# EAGLE design tripoint (EAGLE 9.1.1)
AUTHOR: Andreas Biri; REV: C; TITLE: TriPoint

## Sheet 1 of 2: Localization module
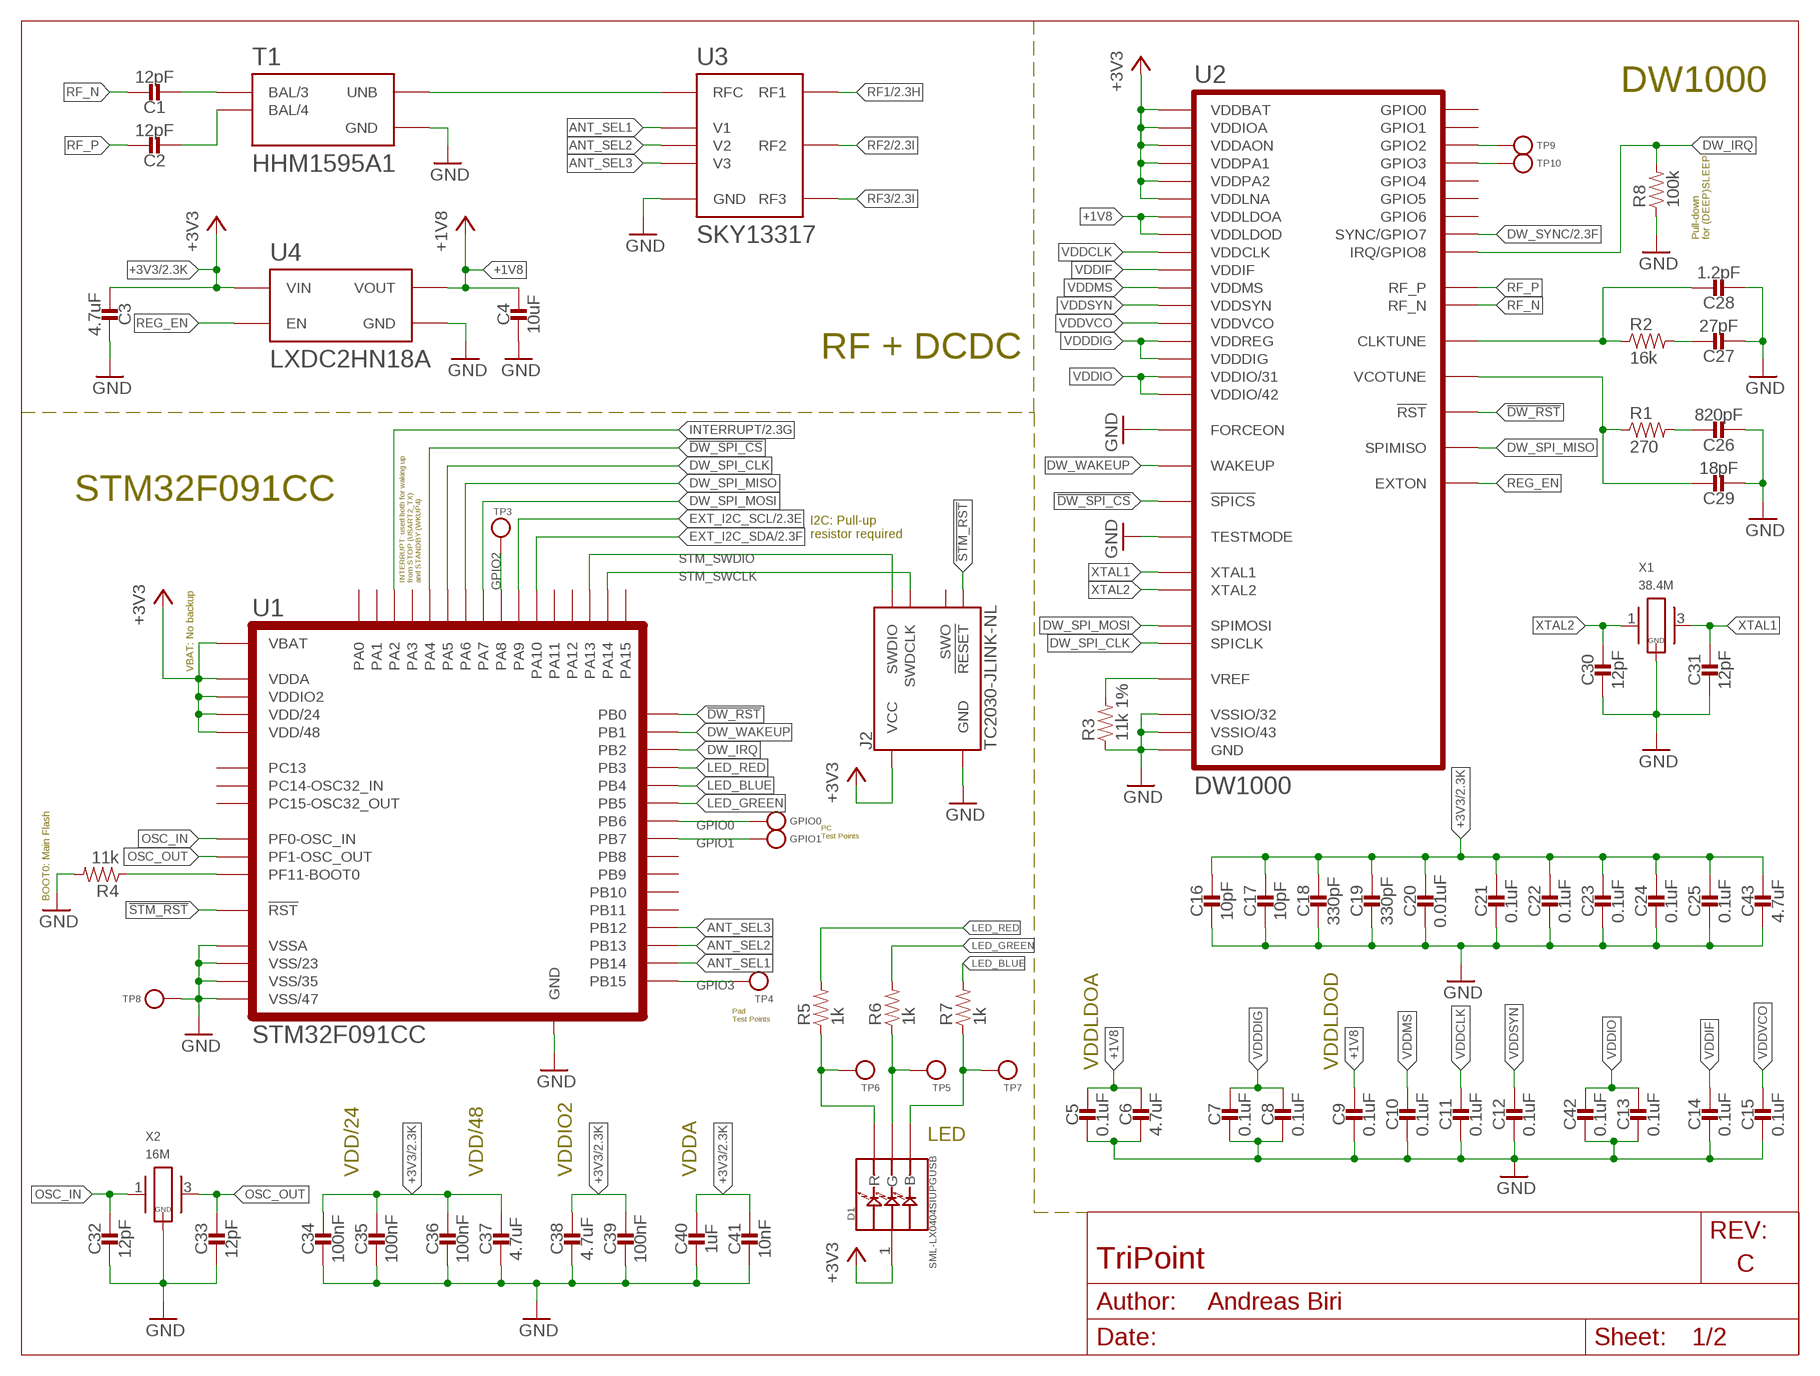
[diagram p0: schematic, sheet 1]

### Parts
C1  12pF  CAPACITOR0201_CAP  [0201_CAP]
C2  12pF  CAPACITOR0201_CAP  [0201_CAP]
C3  4.7uF  CAPACITOR0402_CAP  [0402_CAP]
C4  10uF  CAPACITOR0603_CAP  [0603_CAP]
C5  0.1uF  CAPACITOR0402_CAP  [0402_CAP]
C6  4.7uF  CAPACITOR0402_CAP  [0402_CAP]
C7  0.1uF  CAPACITOR0402_CAP  [0402_CAP]
C8  0.1uF  CAPACITOR0402_CAP  [0402_CAP]
C9  0.1uF  CAPACITOR0402_CAP  [0402_CAP]
C10  0.1uF  CAPACITOR0402_CAP  [0402_CAP]
C11  0.1uF  CAPACITOR0402_CAP  [0402_CAP]
C12  0.1uF  CAPACITOR0402_CAP  [0402_CAP]
C13  0.1uF  CAPACITOR0402_CAP  [0402_CAP]
C14  0.1uF  CAPACITOR0402_CAP  [0402_CAP]
C15  0.1uF  CAPACITOR0402_CAP  [0402_CAP]
C16  10pF  CAPACITOR0402_CAP  [0402_CAP]
C17  10pF  CAPACITOR0402_CAP  [0402_CAP]
C18  330pF  CAPACITOR0402_CAP  [0402_CAP]
C19  330pF  CAPACITOR0402_CAP  [0402_CAP]
C20  0.01uF  CAPACITOR0402_CAP  [0402_CAP]
C21  0.1uF  CAPACITOR0402_CAP  [0402_CAP]
C22  0.1uF  CAPACITOR0402_CAP  [0402_CAP]
C23  0.1uF  CAPACITOR0402_CAP  [0402_CAP]
C24  0.1uF  CAPACITOR0402_CAP  [0402_CAP]
C25  0.1uF  CAPACITOR0402_CAP  [0402_CAP]
C26  820pF  CAPACITOR0402_CAP  [0402_CAP]
C27  27pF  CAPACITOR0402_CAP  [0402_CAP]
C28  1.2pF  CAPACITOR0402_CAP  [0402_CAP]
C29  18pF  CAPACITOR0402_CAP  [0402_CAP]
C30  12pF  CAPACITOR0402_CAP  [0402_CAP]
C31  12pF  CAPACITOR0402_CAP  [0402_CAP]
C32  12pF  CAPACITOR0402_CAP  [0402_CAP]
C33  12pF  CAPACITOR0402_CAP  [0402_CAP]
C34  100nF  CAPACITOR0402_CAP  [0402_CAP]
C35  100nF  CAPACITOR0402_CAP  [0402_CAP]
C36  100nF  CAPACITOR0402_CAP  [0402_CAP]
C37  4.7uF  CAPACITOR0402_CAP  [0402_CAP]
C38  4.7uF  CAPACITOR0402_CAP  [0402_CAP]
C39  100nF  CAPACITOR0402_CAP  [0402_CAP]
C40  1uF  CAPACITOR0402_CAP  [0402_CAP]
C41  10nF  CAPACITOR0402_CAP  [0402_CAP]
C42  0.1uF  CAPACITOR0402_CAP  [0402_CAP]
C43  4.7uF  CAPACITOR0402_CAP  [0402_CAP]
D1  SML-LX0404SIUPGUSB  [1MM_SQ_4PAD]
GPIO0  TEST_POINT_0.040IN  [TESTPOINT_0.040IN]
GPIO1  TEST_POINT_0.040IN  [TESTPOINT_0.040IN]
J2  TC2030-JLINK-NL  [TC2030-IDC-NL]
R1  270  RESISTOR0402_RES  [0402_RES]
R2  16k  RESISTOR0402_RES  [0402_RES]
R3  11k 1%  RESISTOR0402_RES  [0402_RES]
R4  11k  RESISTOR0402_RES  [0402_RES]
R5  1k  RESISTOR0402_RES  [0402_RES]
R6  1k  RESISTOR0402_RES  [0402_RES]
R7  1k  RESISTOR0402_RES  [0402_RES]
R8  100k  RESISTOR0402_RES  [0402_RES]
T1  HHM1595A1  [EIA-0805]
TP3  TEST-POINT  [PAD.03X.03]
TP4  TEST-POINT  [PAD.03X.03]
TP5  TEST-POINT  [PAD.03X.03]
TP6  TEST-POINT  [PAD.03X.03]
TP7  TEST-POINT  [PAD.03X.03]
TP8  TEST-POINT  [PAD.03X.03]
TP9  TEST-POINT  [PAD.03X.03]
TP10  TEST-POINT  [PAD.03X.03]
U1  STM32F091CC  [UFQFPN-48]
U2  DW1000  [QFN-48-DW1000]
U3  SKY13317  [MLPQ-UT-8]
U4  LXDC2HN18A  [LXDC2HN]
X1  38.4M  FA-20H  [FA-20H]
X2  16M  FA-20H  [FA-20H]

### Nets
!DW_RST: U1.18(PB0) U2.27(!RST)
!DW_SPI_CS: U1.14(PA4) U2.24(!SPICS)
!STM_RST: J2.3(!RESET) U1.7(!RST)
+1V8: C4.1 C5.1 C6.1 C9.1 U2.26(VDDLDOD) U2.48(VDDLDOA) U4.3(VOUT)
+3V3: C3.2 C16.1 C17.1 C18.1 C19.1 C20.1 C21.1 C22.1 C23.1 C24.1 C25.1 C34.1 C35.1 C36.1 C37.1 C38.1 C39.1 C40.1 C41.1 C43.1 D1.1(VDD) J2.1(VCC) U1.1(VBAT) U1.9(VDDA) U1.24(VDD/24) U1.36(VDDIO2) U1.48(VDD/48) U2.15(VDDLNA) U2.18(VDDPA1) U2.19(VDDPA2) U2.25(VDDAON) U2.28(VDDIOA) U2.47(VDDBAT) U4.1(VIN) ; also sheet 2
ANT_SEL1: U1.27(PB14) U3.3(V1)
ANT_SEL2: U1.26(PB13) U3.6(V2)
ANT_SEL3: U1.25(PB12) U3.7(V3)
DW_IRQ: R8.2 U1.20(PB2) U2.45(IRQ/GPIO8)
DW_SPI_CLK: U1.15(PA5) U2.41(SPICLK)
DW_SPI_MISO: U1.16(PA6) U2.40(SPIMISO)
DW_SPI_MOSI: U1.17(PA7) U2.39(SPIMOSI)
DW_SYNC: U2.29(SYNC/GPIO7) ; also sheet 2
DW_WAKEUP: U1.19(PB1) U2.23(WAKEUP)
EXT_I2C_SCL: U1.30(PA9) ; also sheet 2
EXT_I2C_SDA: U1.31(PA10) ; also sheet 2
GND: C3.1 C4.2 C5.2 C6.2 C7.2 C8.2 C9.2 C10.2 C11.2 C12.2 C13.2 C14.2 C15.2 C16.2 C17.2 C18.2 C19.2 C20.2 C21.2 C22.2 C23.2 C24.2 C25.2 C26.2 C27.2 C28.2 C29.2 C30.2 C31.2 C32.2 C33.2 C34.2 C35.2 C36.2 C37.2 C38.2 C39.2 C40.2 C41.2 C42.2 C43.2 J2.5(GND) R3.1 R4.2 R8.1 T1.2(GND) T1.5(GND) TP8.P$1(TESTPOINT) U1.8(VSSA) U1.23(VSS/23) U1.35(VSS/35) U1.47(VSS/47) U1.GND U2.22(FORCEON) U2.32(VSSIO/32) U2.43(VSSIO/43) U2.46(TESTMODE) U2.GND U3.GND U4.4(GND) X1.2(GND) X1.4(GND) X2.2(GND) X2.4(GND)
GPIO0: GPIO0.TESTPOINT U1.42(PB6)
GPIO1: GPIO1.TESTPOINT U1.43(PB7)
GPIO2: TP3.P$1(TESTPOINT) U1.29(PA8)
GPIO3: TP4.P$1(TESTPOINT) U1.28(PB15)
INTERRUPT: U1.12(PA2) ; also sheet 2
LED_BLUE: R7.2 U1.40(PB4)
LED_GREEN: R6.2 U1.41(PB5)
LED_RED: R5.2 U1.39(PB3)
N$1: T1.1(UNB) U3.1(RFC)
N$2: C1.P$2 T1.3(BAL/3)
N$3: C2.P$2 T1.4(BAL/4)
N$4: C26.1 R1.2
N$5: C27.1 R2.2
N$6: C29.1 R1.1 U2.12(VCOTUNE)
N$7: R3.2 U2.5(VREF)
N$8: R4.1 U1.44(PF11-BOOT0)
N$9: C28.1 R2.1 U2.8(CLKTUNE)
N$10: D1.4(G) R6.1 TP5.P$1(TESTPOINT)
N$11: D1.3(B) R7.1 TP7.P$1(TESTPOINT)
N$12: D1.2(R) R5.1 TP6.P$1(TESTPOINT)
N$13: TP9.P$1(TESTPOINT) U2.36(GPIO2)
N$14: TP10.P$1(TESTPOINT) U2.35(GPIO3)
OSC_IN: C32.1 U1.5(PF0-OSC_IN) X2.1
OSC_OUT: C33.1 U1.6(PF1-OSC_OUT) X2.3
REG_EN: U2.21(EXTON) U4.2(EN)
RF1: U3.4(RF1) ; also sheet 2
RF2: U3.5(RF2) ; also sheet 2
RF3: U3.8(RF3) ; also sheet 2
RF_N: C1.P$1 U2.17(RF_N)
RF_P: C2.P$1 U2.16(RF_P)
STM_SWCLK: J2.4(SWDCLK) U1.37(PA14)
STM_SWDIO: J2.2(SWDIO) U1.34(PA13)
VDDCLK: C11.1 U2.9(VDDCLK)
VDDDIG: C7.1 C8.1 U2.20(VDDREG) U2.44(VDDDIG)
VDDIF: C14.1 U2.7(VDDIF)
VDDIO: C13.1 C42.1 U2.31(VDDIO/31) U2.42(VDDIO/42)
VDDMS: C10.1 U2.6(VDDMS)
VDDSYN: C12.1 U2.10(VDDSYN)
VDDVCO: C15.1 U2.11(VDDVCO)
XTAL1: C31.1 U2.3(XTAL1) X1.3
XTAL2: C30.1 U2.4(XTAL2) X1.1
Unconnected: J2.6(SWO) U1.2(PC13) U1.3(PC14-OSC32_IN) U1.4(PC15-OSC32_OUT) U1.10(PA0) U1.11(PA1) U1.13(PA3) U1.21(PB10) U1.22(PB11) U1.32(PA11) U1.33(PA12) U1.38(PA15) U1.45(PB8) U1.46(PB9) U2.30(GPIO6) U2.33(GPIO5) U2.34(GPIO4) U2.37(GPIO1) U2.38(GPIO0)

### Notes on the sheet
- DW1000
- Pull-down
  for (DEEP)SLEEP
- RF + DCDC
- STM32F091CC
- I2C: Pull-up
  resistor required
- INTERRUPT: used both for waking up
  from STOP (USART2_TX)
  and STANDBY (WKUP4)
- VBAT: No backup
- PC
  Test Points
- BOOT0: Main Flash
- Pad
  Test Points
- VDDLDOA | VDDLDOD
- LED
- VDD/24 | VDD/48 | VDDIO2 | VDDA

## Sheet 2 of 2: External signals
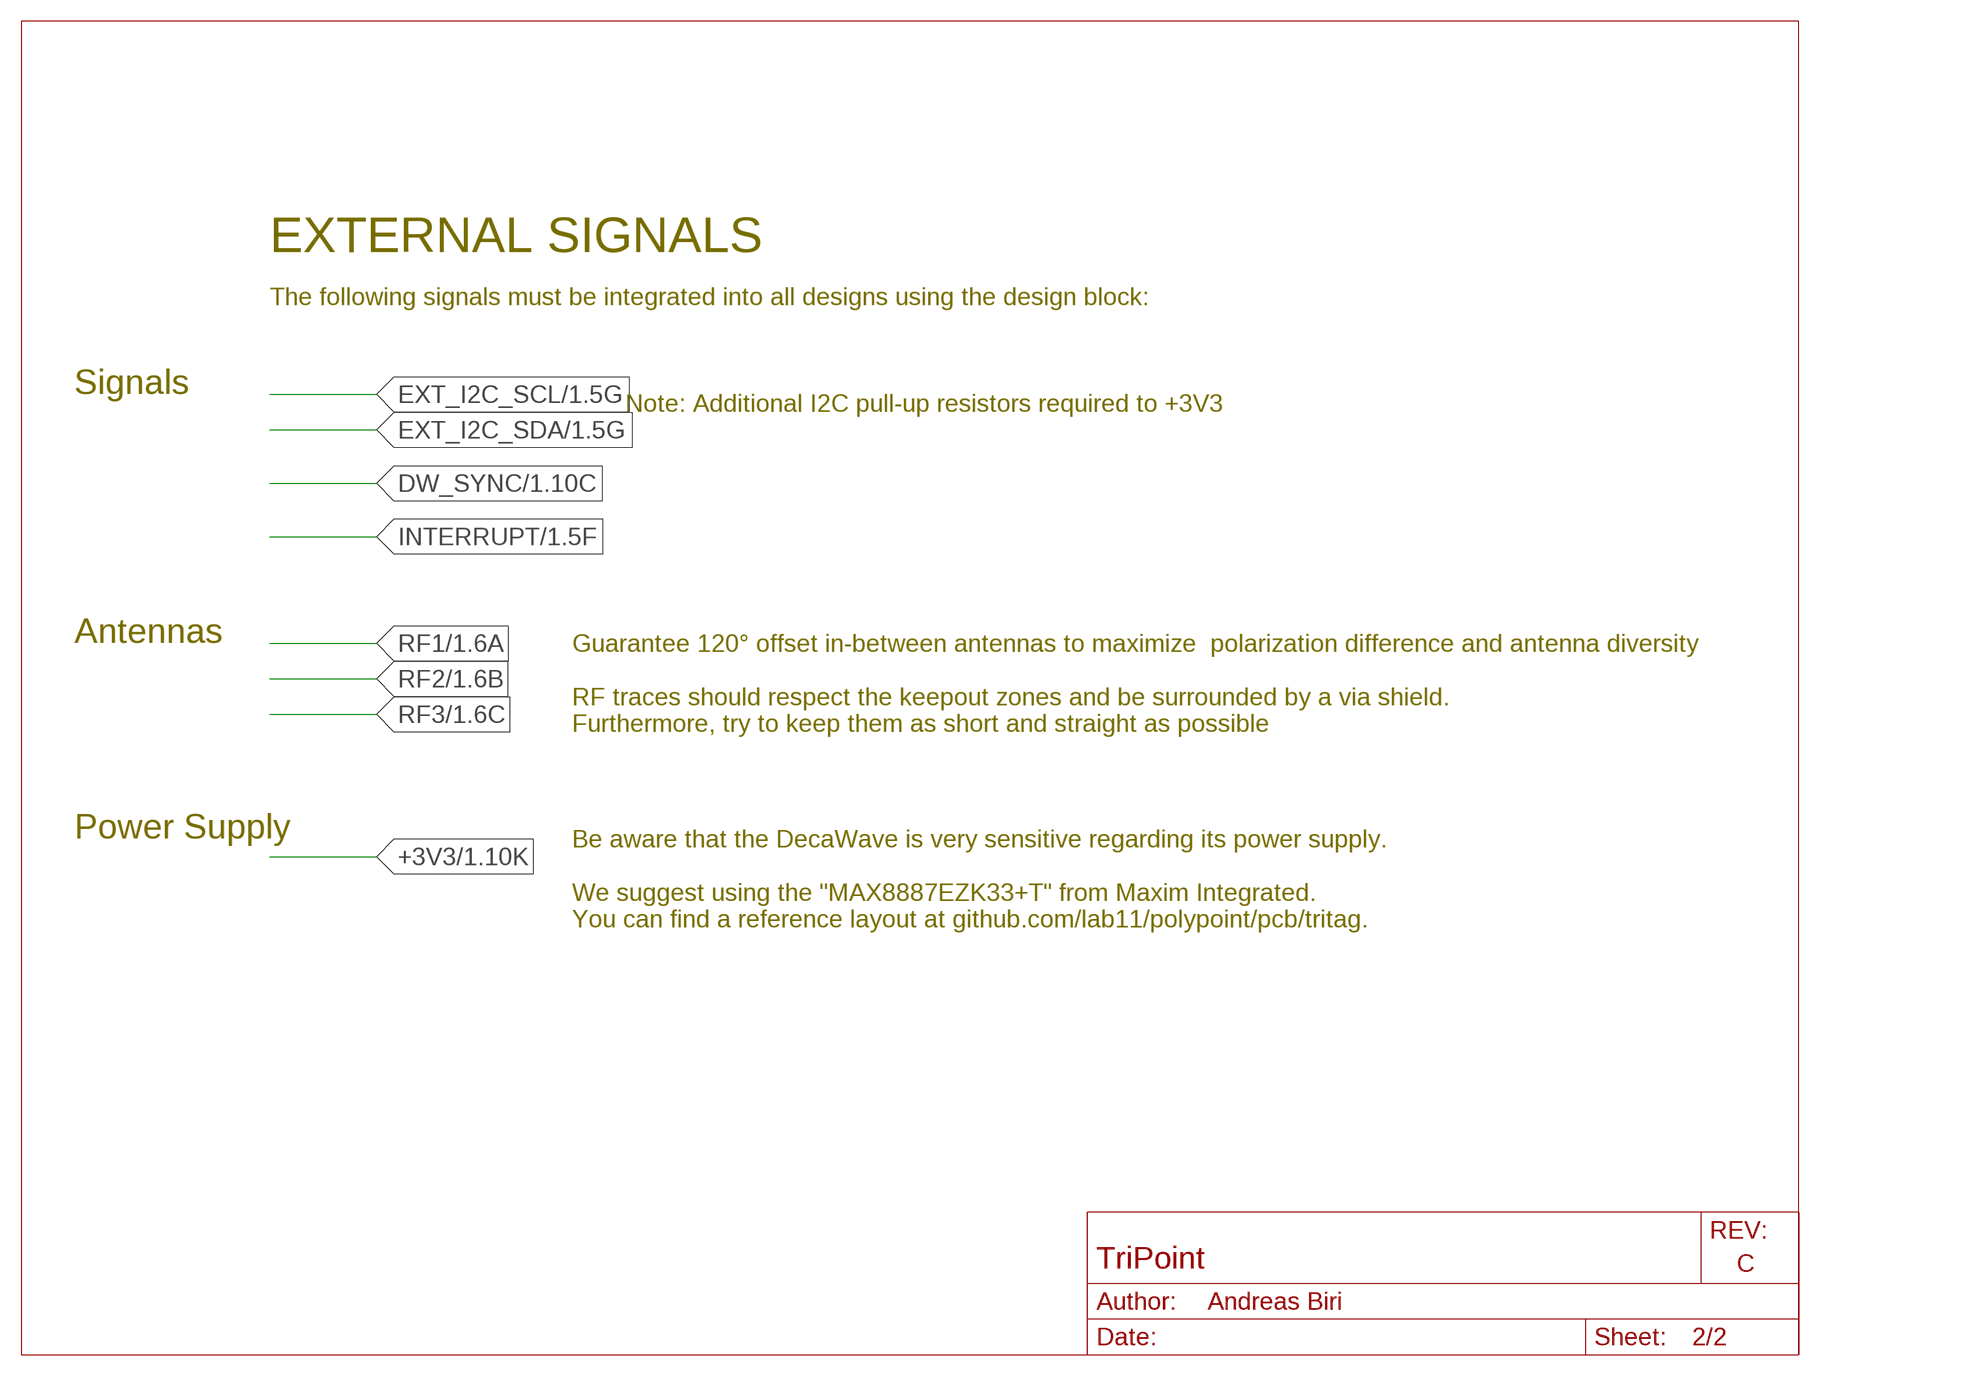
[diagram p1: schematic, sheet 2]

### Notes on the sheet
- EXTERNAL SIGNALS
- The following signals must be integrated into all designs using the design block:
- Signals
- Note: Additional I2C pull-up resistors required to +3V3
- Antennas
- Guarantee 120° offset in-between antennas to maximize  polarization difference and antenna diversity
  
  RF traces should respect the keepout zones and be surrounded by a via shield. 
  Furthermore, try to keep them as short and straight as possible
- Power Supply
- Be aware that the DecaWave is very sensitive regarding its power supply.
  
  We suggest using the "MAX8887EZK33+T" from Maxim Integrated.
  You can find a reference layout at github.com/lab11/polypoint/pcb/tritag.

## Library data of the parts
C1-C43 = passives:CAPACITOR: SMD Capacitor
D1 = leds:SML-LX0404SIUPGUSB: 1mm^2 RGB LED; DIGIKEY: 67-2125-1-ND; MANUFACTURER: Lumex Opto; MPN: SML-LX0404SIUPGUSB
GPIO0 GPIO1 = headers:TEST_POINT_0.040IN: 0.040in Test Point; DIGIKEY: 5001K-ND
J2 = connector:TC2030-JLINK
R1-R8 = passives:RESISTOR: Resistor Basic schematic elements and footprints for 0201, 0402, 0603, 1206, and PTH resistors.
T1 = rf:HHM1595A1: Description: Symbol for HHM1595A1 <https://product.tdk.com/info/en/documents/data_sheet/rf_balun_hhm1595a1_en.pdf>, a multilayer Balun from TDK.; DATASHEET: https://product.tdk.com/info/en/documents/data_sheet/rf_balun_hhm1595a1_en.pdf; DESCRIPTION: XFMR BALUN RF 3.0-8.0GHZ UWB SMD; DIGIKEY: 445-3387-1-ND; MANUFACTURER: TDK Corporation; MOUSER: 810-HHM1595A1; MPN: HHM1595A1
TP3-TP10 = headers:TEST-POINT
U1 = chips:STM32F091CC: Description: STM32F091CC <https://www.st.com/resource/en/datasheet/stm32f091cc.pdf> from STMicroelectronics, an ARM-based 32-bit MCU with 256 kB Flash, 32kB of SRAM and a Cortex M0; DATASHEET: https://www.st.com/resource/en/datasheet/stm32f091cc.pdf; DESCRIPTION: IC MCU 32BIT 256KB FLASH 48QFPN; DIGIKEY: 497-15813-ND; MANUFACTURER: STMicroelectronics; MOUSER: 511-STM32F091CCU6; MPN: STM32F091CCU6
U2 = chips:DW1000: Description: The DecaWave DW1000 <https://www.decawave.com/sites/default/files/resources/dw1000-datasheet-v2.13.pdf> chip, used for UWB two-way ranging.; DATASHEET: https://www.decawave.com/sites/default/files/resources/dw1000-datasheet-v2.13.pdf; DESCRIPTION: IC RF TXRX 802.15.4 48-QFN; DIGIKEY: 1479-1001-1-ND; MANUFACTURER: Decawave Limited; MPN: DW1000-I-TR13
U3 = switches:SKY13317: Description: Device for SKY13317-373LF <http://www.skyworksinc.com/uploads/documents/SKY13317_373LF_200914K.pdf>, an RF switch from Skyworks Inc.; DATASHEET: http://www.skyworksinc.com/uploads/documents/SKY13317_373LF_200914K.pdf; DESCRIPTION: IC SWITCH RF SP3T 8-MLP; DIGIKEY: 863-1056-1-ND; MANUFACTURER: Skyworks Solutions Inc.; MPN: SKY13317-373LF
U4 = regulators:LXDC2HN18A: Description: Symbol for LXDC2HN18A-097 <https://www.murata.com/~/media/webrenewal/campaign/ads/america/udcdc/lxdc_product_brief.ashx>, a DC-DC converter by Murata Electronics. ATTENTION: LAST TIME BUY; DATASHEET: https://www.murata.com/~/media/webrenewal/campaign/ads/america/udcdc/lxdc_product_brief.ashx; DESCRIPTION: DC/DC CONVERTER SMD; DIGIKEY: 490-12092-1-ND; MANUFACTURER: Murata Electronics North America; MPN: LXDC2HN18A-097
X1 = crystals:FA-20H: Description: Oscillator by EPSON from 12MHz to 54 MHz; DATASHEET: https://support.epson.biz/td/api/doc_check.php?dl=brief_FA-20H_en.pdf; DESCRIPTION: 38.4MHz ±10ppm Crystal 8.5pF 40 Ohms 4-SMD, No Lead; DIGIKEY: SER3631CT-ND; MANUFACTURER: EPSON
X2 = crystals:FA-20H: Description: Oscillator by EPSON from 12MHz to 54 MHz; DATASHEET: https://support.epson.biz/td/api/doc_check.php?dl=brief_FA-20H_en.pdf; DESCRIPTION: 16MHz ±10ppm Crystal 8pF 80 Ohms 4-SMD, No Lead; DIGIKEY: SER3913CT-ND; MANUFACTURER: EPSON

## Board
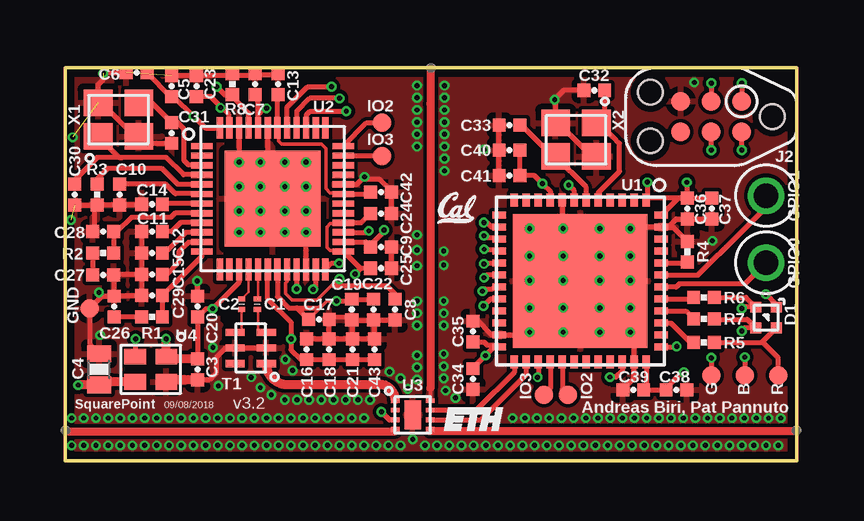
[diagram p2: board, top side]
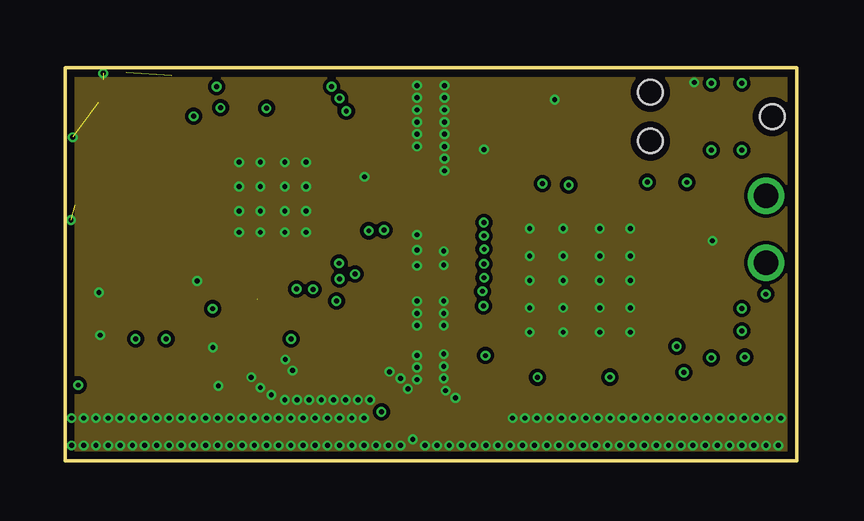
[diagram p3: board, inner layer Route2]
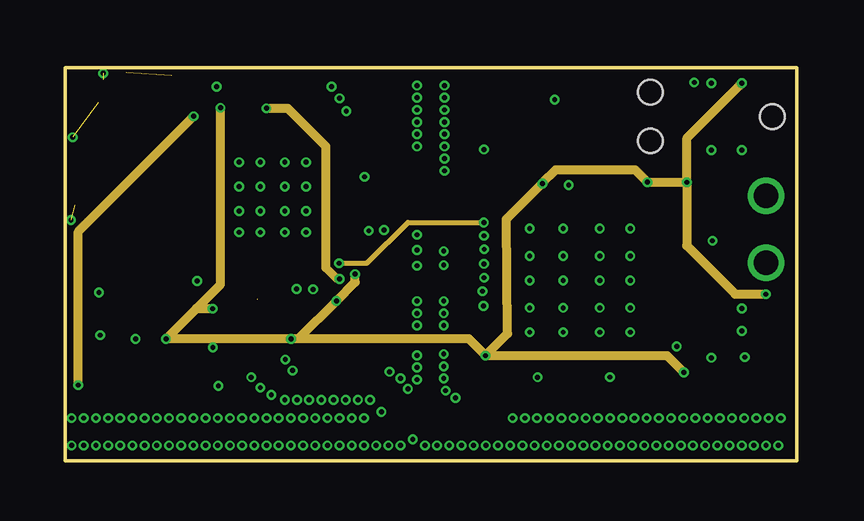
[diagram p4: board, inner layer Route15]
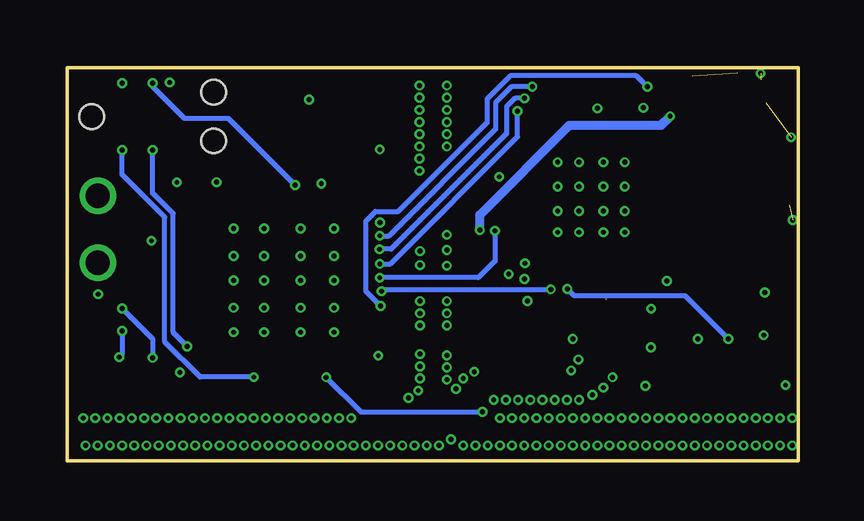
[diagram p5: board, bottom side, seen from below]

Size 30.48 x 16.38 mm. Coordinates in mm from the lower left corner, seen from the top.
Outline: 30.48,0 30.48,16.38 0,16.38 0,0 30.48,0
Copper layers (1+2*15+16): Top 0.0356mm / dielectric 0.18mm / Route2 0.0356mm / dielectric 1.03mm / Route15 0.0356mm / dielectric 0.18mm / Bottom 0.0356mm
Design rules "quickturn_co_kr_1oz_4lyr *": minimum track width 4mil, minimum drill 8mil, track to track 6mil, track to pad 6mil, pad to pad 6mil, via to via 6mil, smd to smd 6mil, copper to edge 12mil, drill to drill 12mil, minimum pad ring 8mil, minimum via ring 4mil, stop-mask expansion 3mil, vias tented up to drill 50mil, thermal gap 10mil
tKeepout: area 0.5,0.1 to 13.5,2.2; area 15.5,0.1 to 30,2.2; area 14.2,2.9 to 16.3,16
tRestrict: area 6.5,5.6 to 7.4,7.1

### Footprints (pad centres in the part's own frame; a part is rotated, then mirrored left to right if it is on the bottom)
0201_CAP = smd 0.3 x 0.21: P$1 0,0.22; P$2 0,-0.22
0402_CAP = smd 0.536 x 0.546: 1 -0.433,0; 2 0.433,0
0603_CAP = smd 0.7 x 1: 1 -0.65,0; 2 0.65,0
1MM_SQ_4PAD = smd 0.457 x 0.457: 1 0.432,0.432; 2 0.432,-0.432; 3 -0.432,-0.432; 4 -0.432,0.432
TESTPOINT_0.040IN = drill 1.016: TESTPOINT 0,0
TC2030-IDC-NL = smd 0.787 x 0.787: 1 -1.27,-0.635; 2 -1.27,0.635; 3 0,-0.635; 4 0,0.635; 5 1.27,-0.635; 6 1.27,0.635 | hole 1.016: -2.54,0; 2.54,1.016; 2.54,-1.016
0402_RES = smd 0.536 x 0.546: 1 -0.433,0; 2 0.433,0
EIA-0805 = smd 0.3 x 0.8: 1 -0.65,-0.65; 2 0,-0.65; 3 0.65,-0.65; 4 0.65,0.65; 5 0,0.65; 6 -0.65,0.65
PAD.03X.03 = smd 0.762 x 0.762: P$1 0,0
UFQFPN-48 = smd 0.55 x 0.3: 1 -3.375,2.75; 2 -3.375,2.25; 3 -3.375,1.75; 4 -3.375,1.25; 5 -3.375,0.75; 6 -3.375,0.25; 7 -3.375,-0.25; 8 -3.375,-0.75; 9 -3.375,-1.25; 10 -3.375,-1.75; 11 -3.375,-2.25; 12 -3.375,-2.75; 25 3.375,-2.75; 26 3.375,-2.25; 27 3.375,-1.75; 28 3.375,-1.25; 29 3.375,-0.75; 30 3.375,-0.25; 31 3.375,0.25; 32 3.375,0.75; 33 3.375,1.25; 34 3.375,1.75; 35 3.375,2.25; 36 3.375,2.75 | smd 0.3 x 0.55: 13 -2.75,-3.375; 14 -2.25,-3.375; 15 -1.75,-3.375; 16 -1.25,-3.375; 17 -0.75,-3.375; 18 -0.25,-3.375; 19 0.25,-3.375; 20 0.75,-3.375; 21 1.25,-3.375; 22 1.75,-3.375; 23 2.25,-3.375; 24 2.75,-3.375; 37 2.75,3.375; 38 2.25,3.375; 39 1.75,3.375; 40 1.25,3.375; 41 0.75,3.375; 42 0.25,3.375; 43 -0.25,3.375; 44 -0.75,3.375; 45 -1.25,3.375; 46 -1.75,3.375; 47 -2.25,3.375; 48 -2.75,3.375 | smd 5.6 x 5.6: GND 0,0
QFN-48-DW1000 = smd 0.9 x 0.26: 1 -2.95,2.2; 2 -2.95,1.8; 3 -2.95,1.4; 4 -2.95,1; 5 -2.95,0.6; 6 -2.95,0.2; 7 -2.95,-0.2; 8 -2.95,-0.6; 9 -2.95,-1; 10 -2.95,-1.4; 11 -2.95,-1.8; 12 -2.95,-2.2; 25 2.95,-2.2; 26 2.95,-1.8; 27 2.95,-1.4; 28 2.95,-1; 29 2.95,-0.6; 30 2.95,-0.2; 31 2.95,0.2; 32 2.95,0.6; 33 2.95,1; 34 2.95,1.4; 35 2.95,1.8; 36 2.95,2.2 | smd 0.26 x 0.9: 13 -2.2,-2.95; 14 -1.8,-2.95; 15 -1.4,-2.95; 16 -1,-2.95; 17 -0.6,-2.95; 18 -0.2,-2.95; 19 0.2,-2.95; 20 0.6,-2.95; 21 1,-2.95; 22 1.4,-2.95; 23 1.8,-2.95; 24 2.2,-2.95; 37 2.2,2.95; 38 1.8,2.95; 39 1.4,2.95; 40 1,2.95; 41 0.6,2.95; 42 0.2,2.95; 43 -0.2,2.95; 44 -0.6,2.95; 45 -1,2.95; 46 -1.4,2.95; 47 -1.8,2.95; 48 -2.2,2.95 | smd 4 x 4: GND 0,0
MLPQ-UT-8 = smd 0.35 x 0.2: 1 -0.725,0.6; 2 -0.725,0.2; 3 -0.725,-0.2; 4 -0.725,-0.6; 5 0.725,-0.6; 6 0.725,-0.2; 7 0.725,0.2; 8 0.725,0.6 | smd 0.7 x 1.2: GND 0,0
LXDC2HN = smd 0.65 x 0.9: 1 -0.525,0.65; 2 -0.525,-0.65; 3 0.525,-0.65; 4 0.525,0.65
FA-20H = smd 1.1 x 1.2: 1 -0.7,0.85; 2 -0.7,-0.85; 3 0.7,-0.85; 4 0.7,0.85

### Placement (x,y rotation side)
C1  8,6.53 0 top
C2  7.34,6.53 0 top
C3  5.51,3.81 90 top
C4  1.4,3.81 90 top
C5  4.42,15.62 90 top
C6  2.97,16.18 180 top
C7  7.9,15.7 90 top
C8  13.74,6.3 270 top
C9  13.16,8.92 0 top
C10  2.26,11.1 270 top
C11  3.61,9.55 180 top
C12  3.61,8.66 180 top
C13  8.86,15.7 90 top
C14  3.61,10.69 180 top
C15  3.61,7.77 180 top
C16  10.06,4.65 90 top
C17  10.57,5.89 0 top
C18  11,4.65 90 top
C19  11.94,6.3 270 top
C20  5.51,6.43 90 top
C21  11.96,4.65 90 top
C22  12.85,6.3 270 top
C23  5.46,15.62 90 top
C24  13.16,10.31 0 top
C25  13.16,8.03 0 top
C26  2.03,6.43 90 top
C27  1.57,7.75 0 top
C28  1.57,9.55 180 top
C29  3.61,6.88 180 top
C30  0.38,11.1 270 top
C31  4.42,13.67 270 top
C32  22.05,15.44 180 top
C33  18.52,14 180 top
C34  16.99,3.4 270 top
C35  16.99,5.38 90 top
C36  25.93,10.52 270 top
C37  26.95,10.52 270 top
C38  25.48,2.95 0 top
C39  23.67,2.95 180 top
C40  18.52,12.95 180 top
C41  18.52,11.89 180 top
C42  13.16,11.2 0 top
C43  12.88,4.65 90 top
D1  29.21,5.97 0 top
GPIO0  29.21,8.25 0 top
GPIO1  29.21,11.05 0 top
J2  26.92,14.35 180 top
R1  3.61,5.99 180 top
R2  1.57,8.66 180 top
R3  1.32,11.1 90 top
R4  25.93,8.71 90 top
R5  26.62,4.93 180 top
R6  26.62,6.81 180 top
R7  26.62,5.92 180 top
R8  6.96,15.7 270 top
T1  7.72,4.7 90 top
TP3  20.95,2.74 0 top
TP4  19.94,2.74 0 top
TP5  26.92,3.56 0 top
TP6  29.72,3.56 0 top
TP7  28.32,3.56 0 top
TP8  1.02,6.35 0 top
TP9  13.21,14.1 0 top
TP10  13.21,12.7 0 top
U1  21.46,7.49 270 top
U2  8.64,10.92 0 top
U3  14.48,1.9 0 top
U4  3.56,3.81 270 top
U$1  [ETH_100MIL]  16.89,1.27 0 top
U$2  [UCB_CAL_50MIL]  15.49,9.91 0 top
X1  2.21,14.22 90 top
X2  21.29,13.39 270 top

### Tracks (layer width: path | path; a pad name or v marks a point on that pad's centre or on a via)
!DW_RST  (via drill 0.2)
  Top 0.203: U2.27 12.58,9.52 v12.65,9.59 | U1.18 18.07,7.76 17.58,7.76 v17.45,7.63
  Bottom 0.203: v17.45,7.63 13.34,7.63 12.65,8.32 v12.65,9.59
!DW_SPI_CS  (via drill 0.2)
  Top 0.203: U2.24 11.1,8.24 v11.41,8.24 | U1.14 17.76,9.74 17.57,9.94 v17.44,9.94
  Route15 0.203: v17.44,9.94 14.27,9.94 12.57,8.24 v11.41,8.24
!STM_RST  (via drill 0.2)
  Top 0.203: U1.7 21.21,11.26 v20.98,11.49 | v26.92,15.75 J2.3
  Bottom 0.203: v20.98,11.49 23.76,14.27 25.59,14.27 26.92,15.6 v26.92,15.75
+1V8  (via drill 0.2)
  Top 0.203: U2.48 5.84,13.87 v5.35,14.36 4.52,15.19 C5.1 4.39,15.19 3.42,16.15 3.42,16.17 C6.1 | U2.26 12.52,9.12 C9.1 12.72,8.99 13.28,9.55 v13.28,9.62
  Top 0.381: U4.3 1.52,3.28 C4.1 0.54,3.16 v0.53,3.15
  Route15 0.381: v0.53,3.15 0.53,9.55 v5.35,14.36
  Bottom 0.381: v5.35,14.36 5.72,13.98 9.55,13.98 13.28,10.25 v13.28,9.62
+3V3  (via drill 0.2)
  Top 0.152: U2.25 11.54,8.76 11.04,8.76 10.91,8.9 10.91,9.75 11.04,9.88 11.54,9.88 U2.28 | U2.47 6.82,13.89 | C17.1 10.57,6.32 10.63,6.39 10.91,6.66 v11.3,6.66
  Top 0.203: U1.48 25.54,10.95 C36.1 | C36.1 C37.1 | C36.1 25.93,11.58 v25.91,11.61 | v28.19,15.75 J2.1 | C36.1 24.29,10.95 U1.1 24.26,10.91 v24.26,11.61 | U1.36 24.21,3.05 C39.1 C38.1 25.04,3.03 25.69,3.68 v25.79,3.68 | 6.82,13.89 6.82,14.43 6.5,14.75 | 6.5,14.75 6.06,15.19 C23.1 | U2.15 7.24,7.43 v6.14,6.34 5.86,6.34 C20.1 C3.2 | U2.18 8.44,6.75 9.41,5.78 v9.41,5.08 9.41,4.63 9.82,4.21 C16.1 C18.1 C21.1 C43.1 | 9.65,6.38 9.31,6.38 8.84,6.85 U2.19 | U2.25 12.28,8.03 C25.1 12.33,8.03 v12.08,7.78 | U2.28 12.33,9.92 C24.1 | C35.1 17.45,4.95 17.58,4.82 18.01,4.82 U1.24 17.87,4.74 v17.51,4.38 16.99,3.86 C34.1 | D1.1 29.64,6.5 v29.2,6.94 | 9.65,6.38 C17.1 | C22.1 C19.1 11.87,6.66 v11.3,6.66 | C40.1 C41.1 19.56,11.89 v19.89,11.56 20.23,11.21 20.23,10.88 U1.9 | 9.65,6.38 10.58,6.38 | v6.46,14.72 6.5,14.75
  Top 0.381: C3.2 4.3,4.24 U4.1 4.21,5.06 v4.19,5.08
  Route15 0.203: v25.9,11.61 v25.91,11.61
  Route15 0.381: v25.91,11.61 25.91,13.46 v28.19,15.75 | 6.46,7.35 v6.46,14.72 | 6.46,7.35 | v17.51,4.38 16.8,5.09 9.73,5.09 | 5.46,6.35 v4.19,5.08 4.2,5.09 9.73,5.09 | 5.46,6.35 6.46,7.35 | v29.2,6.94 27.93,6.94 25.9,8.97 v25.9,11.61 v24.26,11.61 24.26,11.63 23.75,12.14 20.44,12.14 19.88,11.57 v19.89,11.56 19.86,11.56 18.38,10.07 18.43,5.3 v17.51,4.38 | v17.51,4.38 25.08,4.38 v25.79,3.68 | v12.08,7.78 12.08,7.45 v11.3,6.66 9.73,5.1 9.73,5.09 | 5.46,6.35 6.13,6.35 v6.14,6.34 | 9.73,5.09 | v9.41,5.08 9.73,5.09
ANT_SEL1  (via drill 0.2)
  Top 0.152: U3.3 13.83,1.7
  Top 0.203: U1.27 19.71,3.51 v19.69,3.48 | v13.17,2.03 13.51,1.7 13.83,1.7
  Bottom 0.203: v19.69,3.48 18.24,2.03 v13.17,2.03
ANT_SEL2
  Top 0.203: U3.6 17.33,1.71 19.21,3.59 U1.26
ANT_SEL3
  Top 0.203: U1.25 18.71,3.69 17.14,2.11 15.13,2.11 U3.7
DW_IRQ  (via drill 0.2)
  Top 0.203: U2.45 7.64,14.5 6.96,15.18 R8.2 6.63,15.26 v6.3,15.59 | U1.20 17.71,6.74 v17.42,6.46
  Bottom 0.203: v17.42,6.46 18.03,7.07 18.03,9.99 17.63,10.39 16.68,10.39 12.98,14.1 12.98,15.08 12.06,16 12.01,16.05 6.76,16.05 v6.3,15.59
DW_SPI_CLK  (via drill 0.2)
  Top 0.203: U2.41 9.24,14.73 10.1,15.6 v11.09,15.6 | v17.45,9.38 17.53,9.29 18.04,9.29 U1.15
  Bottom 0.203: v17.45,9.38 17.07,9.38 12.62,13.82 12.62,14.93 11.96,15.6 v11.09,15.6
DW_SPI_MISO  (via drill 0.2)
  Top 0.203: U2.40 9.65,13.89 9.65,14.58 10.19,15.11 v11.42,15.11 | v17.46,8.82 17.48,8.79 18.04,8.79 U1.16
  Bottom 0.203: v17.46,8.82 16.98,8.82 12.17,13.63 12.17,14.77 11.82,15.11 v11.42,15.11
DW_SPI_MOSI  (via drill 0.2)
  Top 0.203: U2.39 10.05,13.89 10.05,14.43 10.2,14.58 v11.71,14.58 | v17.45,8.21 v17.46,8.22 18.06,8.22 U1.17
  Bottom 0.203: v17.45,8.21 17.01,8.21 11.71,13.51 v11.71,14.58
DW_WAKEUP  (via drill 0.2)
  Top 0.203: U1.19 17.89,7.24 17.81,7.17 17.48,7.17 v17.38,7.06 | U2.23 10.43,7.96 10.43,7.25 v10.32,7.15
  Bottom 0.203: v10.32,7.15 10.35,7.12 17.44,7.12 v17.38,7.06
GND  (via drill 0.2)  (4 unrouted)
  Top 0.152: 8.76,10.92 U2.GND 8.67,10.96 8.43,11.2 9.14,10.96 8.87,10.68 8.87,11.1 v9.14,11.43
  Top 0.203: 24.87,9.71 25.09,9.71 25.46,10.08 C36.2 C37.2 | 24.87,9.71 U1.47 23.84,9.74 21.53,7.43 | R4.2 25.37,9.71 24.87,9.71 | 21.72,7.24 23.71,5.24 U1.35 23.67,4.07 23.67,3.41 23.24,2.98 C39.2 | 21.72,7.24 21.53,7.43 | 21.53,7.43 U1.GND | 21.72,7.24 19.72,5.24 U1.23 17.77,5.24 17.7,5.32 17.2,5.82 C35.2 | 21.53,7.43 20.71,8.24 U1.8 20.74,10.9 | U2.43 8.44,11.12 8.51,11.05 | 8.51,11.05 U2.GND | U2.46 7.24,12.32 8.51,11.05 | U2.22 10.04,9.65 8.95,10.73 8.76,10.92 | C13.2 8.81,16.08 7.95,16.08 C7.2 7.82,16.05 7.04,16.05 R8.1 6.88,16.05 C23.2 C5.2 | C14.2 3.15,10.67 C10.2 R3.1 | C30.2 R3.1 | C28.2 1.19,9.6 1.19,10.54 R3.1 | C11.2 C12.2 C15.2 | C15.2 2.03,7.77 2.03,7.75 | C15.2 C29.2 3.15,6.86 C26.2 | 1.53,6.86 TP8.P$1 1.02,4.84 C4.2 | 1.53,6.86 C26.2 | C20.2 5.51,7.47 v5.49,7.49 | C3.1 6,3.38 6.29,3.66 6.29,4.3 6.69,4.7 T1.5 T1.2 | C21.2 C43.2 12.88,5.84 | C21.2 C18.2 | C18.2 C16.2 | C18.2 C17.2 11.1,5.99 11.81,5.99 C19.2 | C21.2 11.96,5.84 | 11.96,5.84 C19.2 | 12.88,5.84 C22.2 C8.2 | C19.2 11.96,5.84 | 11.96,5.84 12.88,5.84 | C25.2 C9.2 | C24.2 C42.2 | 13.5,11.2 C42.2 | U2.32 12.14,11.52 12.35,11.73 13.1,11.73 13.59,11.23 C42.2 | C26.2 2.03,7.75 | 2.03,7.75 C27.2 | v1.4,7.01 1.4,6.99 1.53,6.86 | C41.2 C40.2 C33.2 | X2.4 21.94,12.69 20.89,13.74 20.9,13.74 20.56,14.09 X2.2 20.44,15.02 v20.4,15.06 v20.39,15.06 20.78,15.44 C32.2 | C6.2 2.51,16.15 v1.58,16.15 | 1.58,15.9 1.36,15.68 X1.4 1.48,14.92 2.23,14.18 2.88,13.52 X1.2 3.35,13.23 C31.2
  Top 0.381: C3.1 4.3,3.38 U4.4
  other vias: 0.25,1.78 0.76,1.78 1.27,1.78 1.78,1.78 2.29,1.78 2.79,1.78 3.3,1.78 3.81,1.78 4.32,1.78 4.83,1.78 5.33,1.78 5.84,1.78 6.35,1.78 6.86,1.78 7.37,1.78 7.87,1.78 8.38,1.78 8.89,1.78 9.4,1.78 9.91,1.78 10.41,1.78 10.92,1.78 11.43,1.78 11.94,1.78 12.45,1.78 12.7,2.54 12.19,2.54 11.68,2.54 11.18,2.54 10.67,2.54 10.16,2.54 9.65,2.54 9.14,2.54 8.59,2.74 8.13,3.05 7.75,3.48 13.51,3.71 13.97,3.43 14.27,3 14.66,3.38 14.66,3.89 14.66,4.39 14.66,5.64 14.66,6.15 14.66,6.65 14.66,8.13 14.66,8.79 14.66,9.42 15.77,8.74 15.77,8.15 14.66,13.11 14.66,13.61 14.66,14.12 14.66,14.63 14.66,15.14 14.66,15.65 15.8,15.65 15.8,15.14 15.8,14.63 15.8,14.12 15.8,13.61 15.8,13.11 15.8,12.6 15.8,12.09 15.77,6.65 15.77,6.15 15.77,5.64 15.77,4.44 15.77,3.94 15.77,3.43 15.85,2.92 16.26,2.62 18.64,1.78 19.15,1.78 19.66,1.78 20.17,1.78 20.68,1.78 21.18,1.78 21.69,1.78 22.2,1.78 22.71,1.78 23.22,1.78 23.72,1.78 24.23,1.78 24.74,1.78 25.25,1.78 25.76,1.78 26.26,1.78 26.77,1.78 27.28,1.78 27.79,1.78 28.3,1.78 28.8,1.78 29.31,1.78 29.82,1.78 10.03,12.45 8.13,12.45 7.24,12.45 7.24,11.43 8.13,11.43 9.14,12.45 10.03,11.43 10.03,10.41 10.03,9.52 9.14,9.52 8.13,9.52 7.24,9.52 7.24,10.41 8.13,10.41 9.14,10.41 19.35,9.68 20.75,9.68 22.28,9.68 23.55,9.68 23.55,8.53 22.28,8.53 19.35,8.53 22.28,7.52 23.55,7.52 20.75,7.52 20.75,6.38 20.75,5.36 19.35,5.36 22.28,5.36 23.55,5.36 23.55,6.38 22.28,6.38 19.35,6.38 26.21,15.77 17.45,12.98 0.25,0.63 0.76,0.63 1.27,0.63 1.78,0.63 2.29,0.63 2.79,0.63 3.3,0.63 3.81,0.63 4.32,0.63 4.83,0.63 5.33,0.63 5.84,0.63 6.35,0.63 6.86,0.63 7.37,0.63 7.87,0.63 8.38,0.63 8.89,0.63 9.4,0.63 9.91,0.63 10.41,0.63 10.92,0.63 11.43,0.63 11.94,0.63 12.45,0.63 12.95,0.63 13.46,0.63 13.97,0.63 14.48,0.89 14.99,0.63 15.49,0.63 16,0.63 16.51,0.63 17.02,0.63 17.53,0.63 18.03,0.63 18.54,0.63 19.05,0.63 19.56,0.63 20.07,0.63 20.57,0.63 21.08,0.63 21.59,0.63 22.1,0.63 22.61,0.63 23.11,0.63 23.62,0.63 24.13,0.63 24.64,0.63 25.15,0.63 25.65,0.63 26.16,0.63 26.67,0.63 27.18,0.63 27.69,0.63 28.19,0.63 28.7,0.63 29.21,0.63 29.72,0.63 0.23,10.03 0.3,13.49 1.45,5.23 6.15,4.72 6.38,3.12 12.47,11.84 9.17,4.22 26.97,9.17 20.75,8.53 19.35,7.52 9.47,3.76
  pour Top (rank 6): 0,16.38 30.48,16.38 30.48,0 0,0
  pour Route2 (rank 6): 0,16.38 0,0 30.48,0 30.48,16.38
GPIO0
  Top 0.203: GPIO0.TESTPOINT 28.34,7.38 25.61,7.38 25.47,7.24 U1.42
GPIO1
  Top 0.203: U1.43 26.37,7.74 28.11,9.48 29.21,10.58 GPIO1.TESTPOINT
GPIO2
  Top 0.203: U1.29 20.71,2.98 TP3.P$1
GPIO3
  Top 0.203: U1.28 20.21,3.02 TP4.P$1
LED_BLUE
  Top 0.203: U1.40 25.86,6.24 R7.2
LED_GREEN
  Top 0.203: U1.41 26.12,6.74 R6.2
LED_RED
  Top 0.203: U1.39 25.24,5.74 26.06,4.93 R5.2
N$1
  Top 0.152: U3.1 13.74,2.52 13.74,2.54
  Top 0.381: T1.1 arc90 9.25,3.17 13.08,3.17 13.11,3.17 arc-90 13.74,2.54
  pour Top: 13.56,2.54 13.56,2.44 arc90 13.59,2.41 13.59,2.54
N$2
  Top 0.102: T1.3 8.14,5.35 8.03,5.47 8.03,6.28 C1.P$2
N$3
  Top 0.102: C2.P$2 7.34,5.47 7.22,5.35 T1.4
N$4
  Top 0.203: R1.2 C26.1
N$5
  Top 0.203: R2.2 C27.1
N$6
  Top 0.203: U2.12 5.69,8.52 4.41,7.24 4.4,7.24 C29.1 R1.1
N$7
  Top 0.203: U2.5 4.7,11.52 4.04,12.18 1.76,12.18 1.32,11.75 R3.2
N$8
  Top 0.203: U1.44 25.9,8.24 R4.1
N$9
  Top 0.203: U2.8 4.57,10.32 4.39,10.14 2.75,10.14 2.16,9.55 C28.1 R2.1
N$10  (via drill 0.2)
  Top 0.203: R6.1 28.37,6.81 D1.4 28.25,6.4 v28.19,6.35 | v26.92,4.29 TP5.P$1
  Bottom 0.203: v28.19,6.35 26.92,5.08 v26.92,4.29
N$11  (via drill 0.2)
  Top 0.203: v28.19,5.41 28.32,5.54 D1.3 28.42,5.89 27.08,5.89 R7.1 | v28.32,4.32 TP7.P$1
  Bottom 0.203: v28.19,5.41 28.19,4.44 v28.32,4.32
N$12
  Top 0.203: R5.1 29.08,4.93 | D1.2 29.06,4.95 29.08,4.93 | TP6.P$1 29.72,4.29 29.08,4.93
N$13
  Top 0.203: U2.36 12.56,14.1 TP9.P$1
N$14
  Top 0.203: U2.35 13.19,12.72 TP10.P$1
OSC_IN
  Top 0.203: X2.1 22.19,14.14 | 22.19,14.14 22.48,14.43 C32.1 | U1.5 22.21,11.17 23.1,12.06 23.1,13.23 22.84,13.49 22.83,13.49 22.19,14.14
OSC_OUT
  Top 0.203: U1.6 21.71,11.41 X2.3 20.33,12.69 19.02,14 C33.1
REG_EN  (via drill 0.2)
  Top 0.203: U2.21 v9.64,7.16 | v2.92,5.08 2.91,5.06 U4.2
  Bottom 0.203: v9.64,7.16 9.36,6.88 4.72,6.88 v2.92,5.08
RF1
  Top 0.152: 13.73,1.28 U3.4 13.73,1.28 | 13.73,1.22 13.77,1.23 | 13.77,1.23 13.73,1.28 | 13.73,1.28 13.77,1.23 | 13.77,1.23 13.73,1.22 | 13.77,1.23 13.73,1.22
  Top 0.33: 0.1,1.23 13.77,1.23
RF2
  Top 0.152: U3.5 15.23,1.28 | 15.23,1.22 15.19,1.23 | 15.19,1.23 15.23,1.28 | U3.5 15.23,1.28 | 15.23,1.28 15.19,1.23 | 15.19,1.23 15.23,1.22 | U3.5 15.23,1.28 | 15.23,1.28 15.19,1.23 | 15.19,1.23 15.23,1.22 | U3.5 15.23,1.28 | 15.23,1.28 15.19,1.23 | 15.19,1.23 15.23,1.22 | 15.19,1.23 15.23,1.28
  Top 0.33: 30.45,1.23 15.19,1.23
RF3
  Top 0.152: 15.21,3.02 15.21,2.52 U3.8
  Top 0.33: 15.21,16.38 15.21,14.88 15.21,3.02
  pour Top (no thermals): 15.37,2.54 15.37,3 15.06,3 15.04,2.59
RF_N  (1 unrouted)
  Top 0.102: U2.17 8.04,6.77 8,6.73
RF_P
  Top 0.102: U2.16 7.64,7.04 C2.P$1
STM_SWCLK  (via drill 0.2)
  Top 0.203: U1.37 25.46,4.74 v25.48,4.77 | v26.92,12.95 J2.4
  Bottom 0.203: v25.48,4.77 26.06,5.35 26.06,10.31 26.92,11.17 v26.92,12.95
STM_SWDIO  (via drill 0.2)
  Top 0.203: U1.34 23.21,3.74 22.96,3.48 v22.7,3.48 | v28.19,12.95 J2.2
  Bottom 0.203: v22.7,3.48 24.95,3.48 26.42,4.95 26.42,10.16 28.19,11.94 v28.19,12.95
VDDCLK
  Top 0.203: U2.9 4.8,9.92 4.43,9.56 C11.1
VDDDIG  (via drill 0.2)
  Top 0.152: U2.20 9.24,7.46 9.19,7.41 9.19,6.97 9.45,6.71 10.49,6.71 11.2,7.41 | U2.44 8.04,14.38 8.35,14.7 v8.38,14.7 | 11.37,7.58 11.2,7.41 | 11.17,7.3 11.2,7.33 11.2,7.38 11.2,7.41
  Top 0.203: U2.44 8.04,15.13 C7.1 | 11.17,7.3 13.38,7.3 13.74,6.95 C8.1 | v11.42,7.58 11.37,7.58
  Route15 0.33: 10.85,8.05 11.32,7.58 v11.42,7.58
  Route15 0.381: 10.85,8.05 10.85,13.12 9.27,14.7 v8.38,14.7
VDDIF
  Top 0.203: U2.7 4.07,10.72 C14.1
VDDIO
  Top 0.152: U2.31 11.54,11.16 11.04,11.16 10.87,11.34 10.87,13.02 10.69,13.19 9.01,13.19 8.88,13.33 8.88,13.83 U2.42
  Top 0.203: U2.42 8.84,15.24 C13.1 | U2.31 12.64,11.12 C42.1
VDDMS
  Top 0.203: U2.6 5.67,11.14 4.58,11.14 4.18,11.53 C10.1
VDDSYN
  Top 0.203: U2.10 5.03,9.52 4.17,8.66 C12.1
VDDVCO
  Top 0.203: C15.1 4.21,7.77 4.73,8.29 4.73,8.7 5.13,9.11 5.67,9.11 U2.11
XTAL1
  Top 0.203: 5.67,12.34 U2.3 5.67,12.34 | 5.67,12.34 5.13,12.34 4.95,12.52 4.95,13.83 4.68,14.1 C31.1 3.59,14.92 X1.3
XTAL2
  Top 0.203: 2.39,12.65 2.46,12.65 4.2,12.65 4.92,11.92 U2.4 | C30.1 0.38,11.71 1.32,12.65 2.39,12.65 | X1.1 2.23,12.65 2.39,12.65

### Text on the board
tPlace: IO2 | IO3 | GND | IO3 | IO2 | G | B | R | SquarePoint | 09/08/2018 | v3.2 | Andreas Biri, Pat Pannuto